# EasyEDA Pro project modern-cadet-v2.eprj, board key-socket
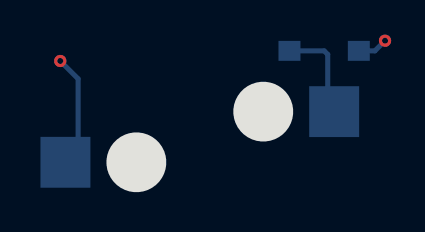
[diagram p4: board, top side]
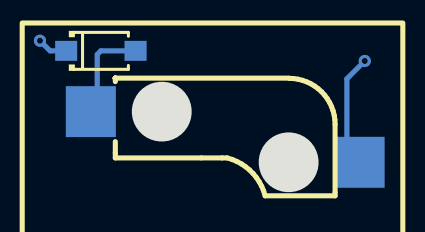
[diagram p5: board, bottom side, seen from below]

Outline 9.34 x 5.53 mm; copper layers: Top Layer, Bottom Layer. Coordinates in mm from the lower left corner of the outline.
Stack: Top Layer 0.035mm / Dielectric1 1.51mm FR4 er 4.5 / Bottom Layer 0.035mm

## Design rules (mm)
template: JLCPCB Capability(Two Layers Board)
spacing copperThickness1oz (default): track to track 0.102, other pairs 0.152 to 0.3
spacing copperThickness2oz: track to track 0.203, other pairs 0.152 to 0.3
track width copperThickness1oz (default): min 0.127, default 0.254, max 2.54
track width copperThickness2oz: min 0.203, default 0.254, max 2.54
differential pair differentialPair (default): width min 0.127, default 0.254, max 2.54; gap min 0.152, default 0.152
via viaSize (default): diameter min 0.5, default 0.61, max 10; hole min 0.3, default 0.305, max 6.3

## Placement (name value [footprint] x y rotation side)
D1  1N4148W  [SOD-123F_L2.7-W1.6-LS3.8-RD]  10.89 7.08 180 bottom
U1  CPG151101S11-16  [SMD_KEYBOARD-SW]  4.67 2.77 0 bottom

## Footprints (pads in the part's own frame, mm; a bottom-side part is the same pattern mirrored in y, then rotated)
SMD_KEYBOARD-SW
  rect 2.5x2.55 smd: 1(-6.725,1.27) 2(6.725,-1.27)
SOD-123F_L2.7-W1.6-LS3.8-RD
  rect 1.1x1 smd: 1(-1.735,0) 2(1.735,0)

## Nets
As in the schematic.

## Via types
v1: diameter 0.61, hole 0.305, Top Layer to Bottom Layer, 2 vias

## Routing (per net, layer and track width the routed paths; a pad name or vN(x,y) marks a point on that pad's centre or on a via; arc(x,y) is an arc through that point)
COL: length 1.5
  Bottom Layer w0.254: v1(13.94,7.59) 13.43,7.08 D1.1
ROW: length 5.5
  Bottom Layer w0.254: -1.42,1.5 -1.42,5.68 v1(-2.31,6.58)
$1N478: length 5.3
  Bottom Layer w0.254: 12.03,4.04 11.07,4.99 11.07,6.9 10.89,7.08 D1.2
